# EAGLE design RN41Board (EAGLE 9.3.1)
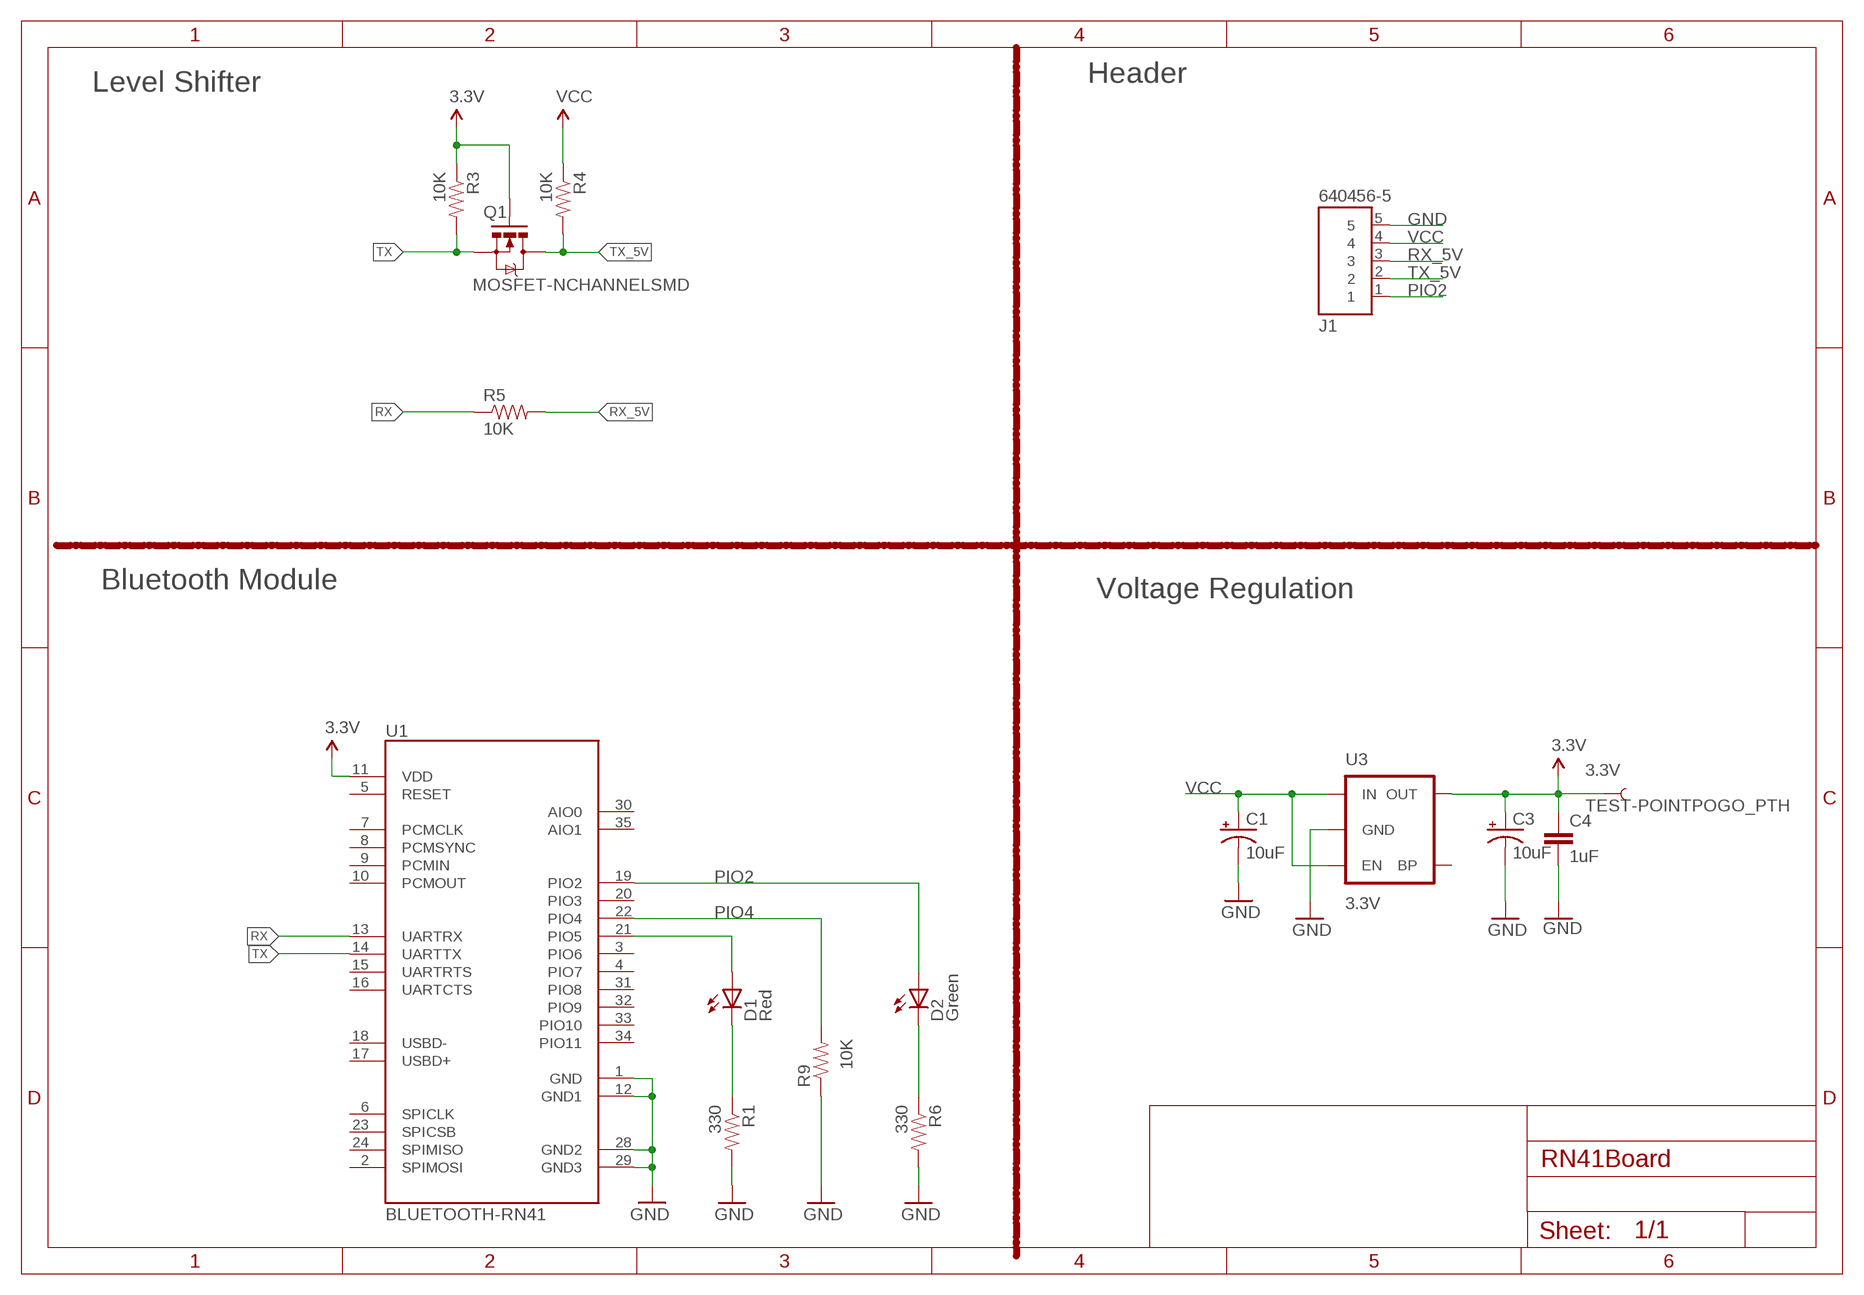
[diagram p0: schematic, sheet 1]

## Parts
3.3V  TEST-POINTPOGO_PTH  [1X01_NO_SILK]
C1  10uF  CAP_POL1206  [EIA3216]
C3  10uF  CAP_POL1206  [EIA3216]
C4  1uF  CAP0603-CAP  [0603-CAP]
D1  Red  LED0603  [LED-0603]
D2  Green  LED0603  [LED-0603]
J1  640456-5  [TE_640456-5]
Q1  MOSFET-NCHANNELSMD  [SOT23-3]
R1  330  RESISTOR0603-RES  [0603-RES]
R3  10K  RESISTOR0603-RES  [0603-RES]
R4  10K  RESISTOR0603-RES  [0603-RES]
R5  10K  RESISTOR0603-RES  [0603-RES]
R6  330  RESISTOR0603-RES  [0603-RES]
R9  10K  RESISTOR0603-RES  [0603-RES]
U1  BLUETOOTH-RN41  BLUETOOTH-RN41"  [RN41]
U3  3.3V  V_REG_LDOSMD  [SOT23-5]

## Nets
3.3V: 3.3V.1 C3.A(+) C4.1 Q1.1(G) R3.1 U1.11(VDD) U3.5(OUT)
D1: D1.C R1.1
D2: D2.C R6.1
GND: C1.C(-) C3.C(-) C4.2 J1.5 R1.2 R6.2 R9.1 U1.1(GND) U1.12(GND1) U1.28(GND2) U1.29(GND3) U3.2(GND)
N$1: D1.A U1.21(PIO5)
PIO2: D2.A J1.1 U1.19(PIO2)
PIO4: R9.2 U1.22(PIO4)
RX: R5.1 U1.13(UARTRX)
RX_5V: J1.3 R5.2
TX: Q1.2(S) R3.2 U1.14(UARTTX)
TX_5V: J1.2 Q1.3(D) R4.2
VCC: C1.A(+) J1.4 R4.1 U3.1(IN) U3.3(EN)
Unconnected: U1.2(SPIMOSI) U1.3(PIO6) U1.4(PIO7) U1.5(RESET) U1.6(SPICLK) U1.7(PCMCLK) U1.8(PCMSYNC) U1.9(PCMIN) U1.10(PCMOUT) U1.15(UARTRTS) U1.16(UARTCTS) U1.17(USBD+) U1.18(USBD-) U1.20(PIO3) U1.23(SPICSB) U1.24(SPIMISO) U1.30(AIO0) U1.31(PIO8) U1.32(PIO9) U1.33(PIO10) U1.34(PIO11) U1.35(AIO1) U3.4(BP)

## Notes on the sheet
- Header
- Level Shifter
- Bluetooth Module
- Voltage Regulation

## Library data of the parts
3.3V = SparkFun-Connectors:TEST-POINT: SparkFun Test Points Bare copper test points for troubleshooting or In-Circuit-Testing. These are used by our Production team for verifying production board runs using pogo-pins on test beds. SparkFun Products: SparkFun LSM9DS1 Breakout <https://www.sparkfun.com/products/13284> SparkFun PSOC <https://www.sparkfun.com/products/13714> SparkFun Load Cell Amplifier <https://www.sparkfun.com/products/13879>
C1 C3 = SparkFun:CAP_POL: Capacitor Polarized These are standard SMD and PTH capacitors. Normally 10uF, 47uF, and 100uF in electrolytic and tantalum varieties. Always verify the external diameter of the through hole cap, it varies with capacity, voltage, and manufacturer. The EIA devices should be standard.
C4 = SparkFun:CAP: Capacitor Standard 0603 ceramic capacitor, and 0.1" leaded capacitor.
D1 D2 = SparkFun:LED: LEDs Standard schematic elements and footprints for 5mm, 3mm, 1206, and 0603 sized LEDs. 5mm - Spark Fun Electronics SKU : COM-00529 (and others)
J1 = 640456-5:640456-5: CONN HEADER VERT 5POS .100 TIN; CENTERLINE_PITCH: 2.54 mm[.1 in]; COMMENT: 640456-5; DESCRIPTION: 05P MTA100 HDR ASSY F/L SQ STR; DIGI-KEY_PART_NUMBER: A19471-ND; DIGI-KEY_PURCHASE_URL: https://www.digikey.com/product-detail/en/te-connectivity-amp-connectors/640456-5/A19471-ND/259011?utm_source=snapeda&utm_medium=aggregator&utm_campaign=symbol; EU_ROHS_COMPLIANCE: Compliant; MF: TE Connectivity; MP: 640456-5; NUMBER_OF_POSITIONS: 5; PACKAGE: None; PRODUCT_TYPE: Connector; TE_PURCHASE_URL: https://www.te.com/usa-en/product-640456-5.html?te_bu=Cor&te_type=disp&te_campaign=seda_glo_cor-seda-global-disp-prtnr-fy19-seda-model-bom-cta_sma-317_1&elqCampaignId=32493
Q1 = SparkFun:MOSFET-NCHANNEL
R1 R3-R6 R9 = SparkFun:RESISTOR: Resistor Basic schematic elements and footprints for 0603, 1206, and PTH resistors.
U1 = SparkFun-RF:BLUETOOTH-RN41: Bluetooth SMD module
U3 = SparkFun:V_REG_LDO: Voltage Regulator LDO Standard 150mA LDO voltage regulator in SOT-23 layout. Micrel part MIC5205. BP (by-pass) pin is used to lower output noise with 470pF cap.

## Board
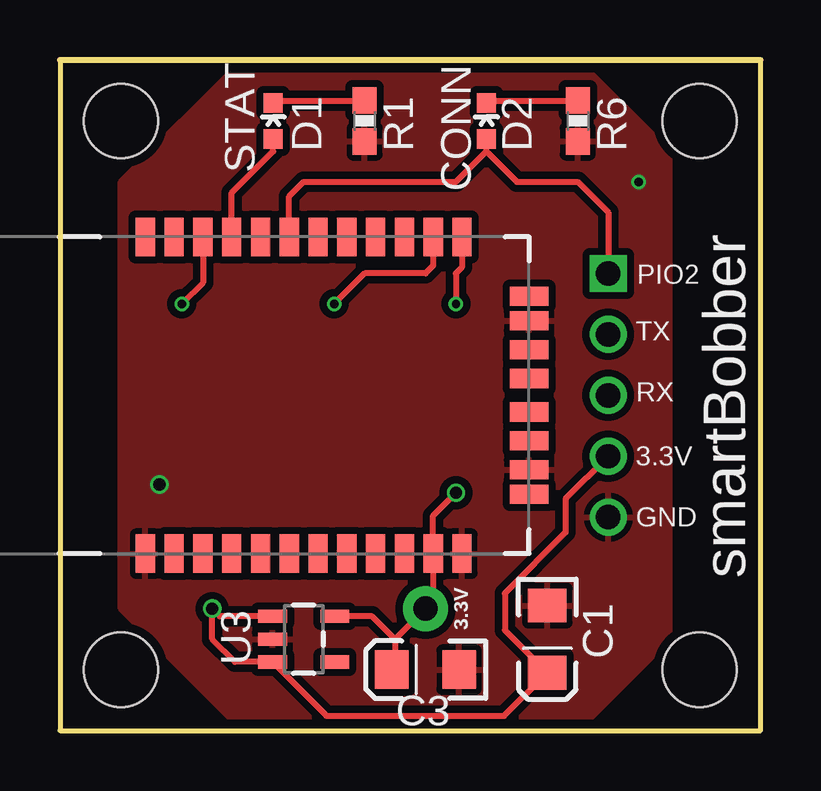
[diagram p1: board, top side]
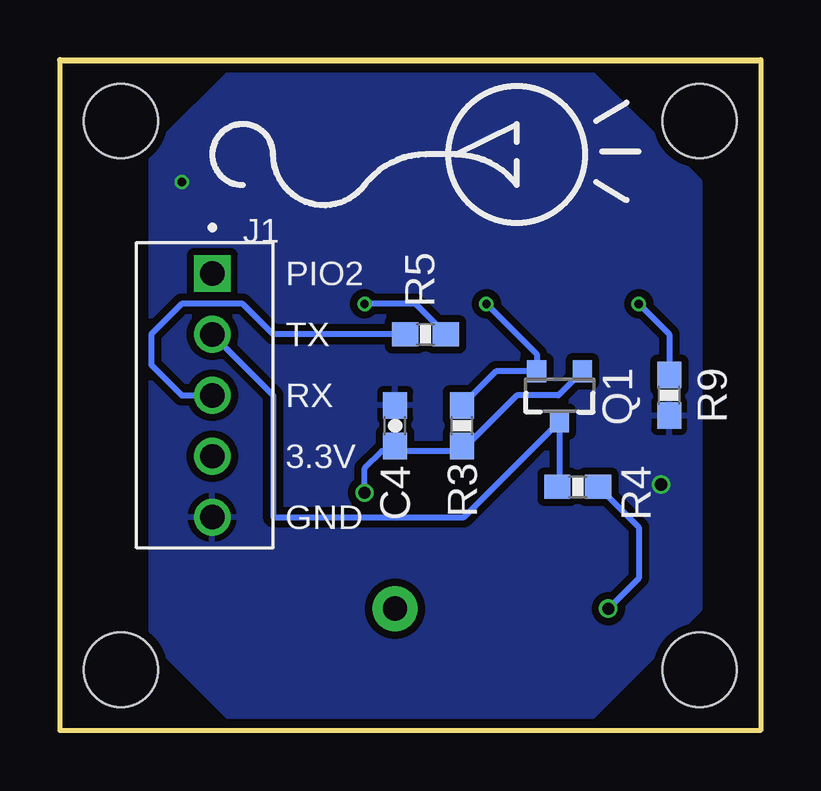
[diagram p2: board, bottom side, seen from below]

Size 29.21 x 27.94 mm. Coordinates in mm from the lower left corner, seen from the top.
Outline: 0,0 29.21,0 29.21,27.94 0,27.94 0,0
Copper layers (1*16): Top 0.035559375mm / dielectric 1.6mm / Bottom 0.035559375mm
Design rules "oshpark-2layer": minimum track width 6mil, minimum drill 10mil, track to track 6mil, track to pad 6mil, pad to pad 6mil, via to via 6mil, smd to smd 6mil, copper to edge 15mil, drill to drill 6mil, minimum pad ring 5mil, minimum via ring 5mil, stop-mask expansion 2.5mil, vias tented up to drill 0mil, thermal gap 10mil
Holes 3.1 mm at 2.54,25.4 2.54,2.54 26.67,25.4 26.67,2.54

### Footprints (pad centres in the part's own frame; a part is rotated, then mirrored left to right if it is on the bottom)
1X01_NO_SILK = drill 1.016 pad 1.88: 1 0,0
EIA3216 = smd 1.4 x 1.6: A 1.4,0; C -1.4,0
0603-CAP = smd 1.1 x 1: 1 -0.85,0; 2 0.85,0
LED-0603 = smd 0.8 x 0.8: A 0,-0.75; C 0,0.75
TE_640456-5 = drill 1.02 square: 1 0,0 | drill 1.02: 2 2.54,0; 3 5.08,0; 4 7.62,0; 5 10.16,0
SOT23-3 = smd 0.8 x 0.9: 1 -0.95,-1; 2 0.95,-1; 3 0,1.1
0603-RES = smd 1.1 x 1: 1 -0.85,0; 2 0.85,0
RN41 = smd 0.8 x 1.6: 1 -6.6,-6.6; 2 -5.4,-6.6; 3 -4.2,-6.6; 4 -3,-6.6; 5 -1.8,-6.6; 6 -0.6,-6.6; 7 0.6,-6.6; 8 1.8,-6.6; 9 3,-6.6; 10 4.2,-6.6; 11 5.4,-6.6; 12 6.6,-6.6; 13 6.6,6.6; 14 5.4,6.6; 15 4.2,6.6; 16 3,6.6; 17 1.8,6.6; 18 0.6,6.6; 19 -0.6,6.6; 20 -1.8,6.6; 21 -3,6.6; 22 -4.2,6.6; 23 -5.4,6.6; 24 -6.6,6.6 | smd 1.6 x 0.8: 28 9.4,3.1; 29 9.4,-3.1; 30 9.4,4.122; 31 9.4,1.9; 32 9.4,0.7; 33 9.4,-0.7; 34 9.4,-1.9; 35 9.4,-4.122
SOT23-5 = smd 0.55 x 1.2: 1 -0.95,-1.3; 2 0,-1.3; 3 0.95,-1.3; 4 0.95,1.3; 5 -0.95,1.3

### Placement (x,y rotation side)
3.3V  15.24,5.08 0 top
C1  20.32,3.81 270 top
C3  15.24,2.54 180 top
C4  15.24,12.7 90 bottom
D1  8.89,25.4 0 top
D2  17.78,25.4 0 top
J1  22.86,19.05 270 bottom
Q1  8.38,13.97 180 bottom
R1  12.7,25.4 270 top
R3  12.45,12.7 90 bottom
R4  7.62,10.16 180 bottom
R5  13.97,16.51 180 bottom
R6  21.59,25.4 270 top
R9  3.81,13.97 90 bottom
U1  10.16,13.97 0 top
U3  10.16,3.81 270 top

### Tracks (layer width: path | path; a pad name or v marks a point on that pad's centre or on a via)
3.3V  (via drill 0.51)
  Top 0.254: 13.97,3.81 13.02,4.76 U3.5 | 13.97,3.81 3.3V.1 15.56,5.4 U1.11 15.56,8.96 v16.51,9.91 | 13.97,3.81 13.97,2.67 C3.A
  Bottom 0.254: C4.1 15.45,11.64 | Q1.1 8.43,13.97 10.16,13.97 12.28,11.85 R3.1 12.66,11.64 15.45,11.64 | v16.51,9.91 16.51,10.92 15.79,11.64 15.45,11.64
D1
  Top 0.254: D1.C 8.99,26.25 R1.1
D2
  Top 0.254: D2.C 17.88,26.25 R6.1
GND  (via drill 0.35, 0.51)
  other vias: 4.14,10.26 24.13,22.86
  pour Top (isolate 0.305): 2.54,22.86 7.62,27.94 21.59,27.94 25.4,24.13 25.4,3.81 21.59,0 7.62,0 2.54,5.08
  pour Bottom (isolate 0.305): 2.54,22.86 7.62,27.94 21.59,27.94 25.4,24.13 25.4,3.81 21.59,0 7.62,0 2.54,5.08
N$1
  Top 0.254: U1.21 7.16,22.4 8.89,24.13 D1.A
PIO2
  Top 0.254: U1.19 9.56,22.26 10.16,22.86 16.51,22.86 17.78,24.13 | 17.78,24.13 D2.A | 17.78,24.13 19.05,22.86 21.59,22.86 22.86,21.59 J1.1
PIO4  (via drill 0.35)
  Top 0.254: U1.22 5.96,18.66 v5.08,17.78
  Bottom 0.254: v5.08,17.78 3.81,16.51 R9.2
RX  (via drill 0.35)
  Top 0.254: U1.13 16.76,19.3 16.51,19.05 v16.51,17.78
  Bottom 0.254: R5.1 14.39,17.78 v16.51,17.78
RX_5V
  Bottom 0.254: R5.2 20.32,16.51 21.59,17.78 24.13,17.78 25.4,16.51 25.4,15.24 24.13,13.97 J1.3
TX  (via drill 0.35)
  Top 0.254: U1.14 15.56,19.37 15.24,19.05 12.7,19.05 v11.43,17.78
  Bottom 0.254: v11.43,17.78 9.33,15.68 Q1.2 11.03,14.97 R3.2
TX_5V
  Bottom 0.254: R4.2 8.38,10.25 Q1.3 12.36,8.89 20.32,8.89 20.32,13.97 J1.2
VCC  (via drill 0.51)
  Top 0.254: U3.1 6.67,4.76 v6.35,5.08 6.35,3.81 7.3,2.86 U3.3 11.11,0.61 18.52,0.61 C1.A 18.54,4.19 18.54,5.71 21.08,8.26 21.08,9.65 J1.4
  Bottom 0.254: R4.1 5.08,8.47 5.08,6.35 v6.35,5.08

### Text on the board
tPlace: STAT | CONN | PIO2 | TX | RX | 3.3V | GND | smartBobber
bPlace: PIO2 | TX | RX | 3.3V | GND